# Altium schematic sheet BOOT_JTAG_AUX.SchDoc: =project_title
size Tabloid; CompanyName: Luxonis Holding; Organization: Luxonis Holding; Address1: 1925 Harmony Park Drive; Address2: Westminster, CO; Address3: 80234; Address4: United States; SheetNumber: 7; SheetTotal: 14
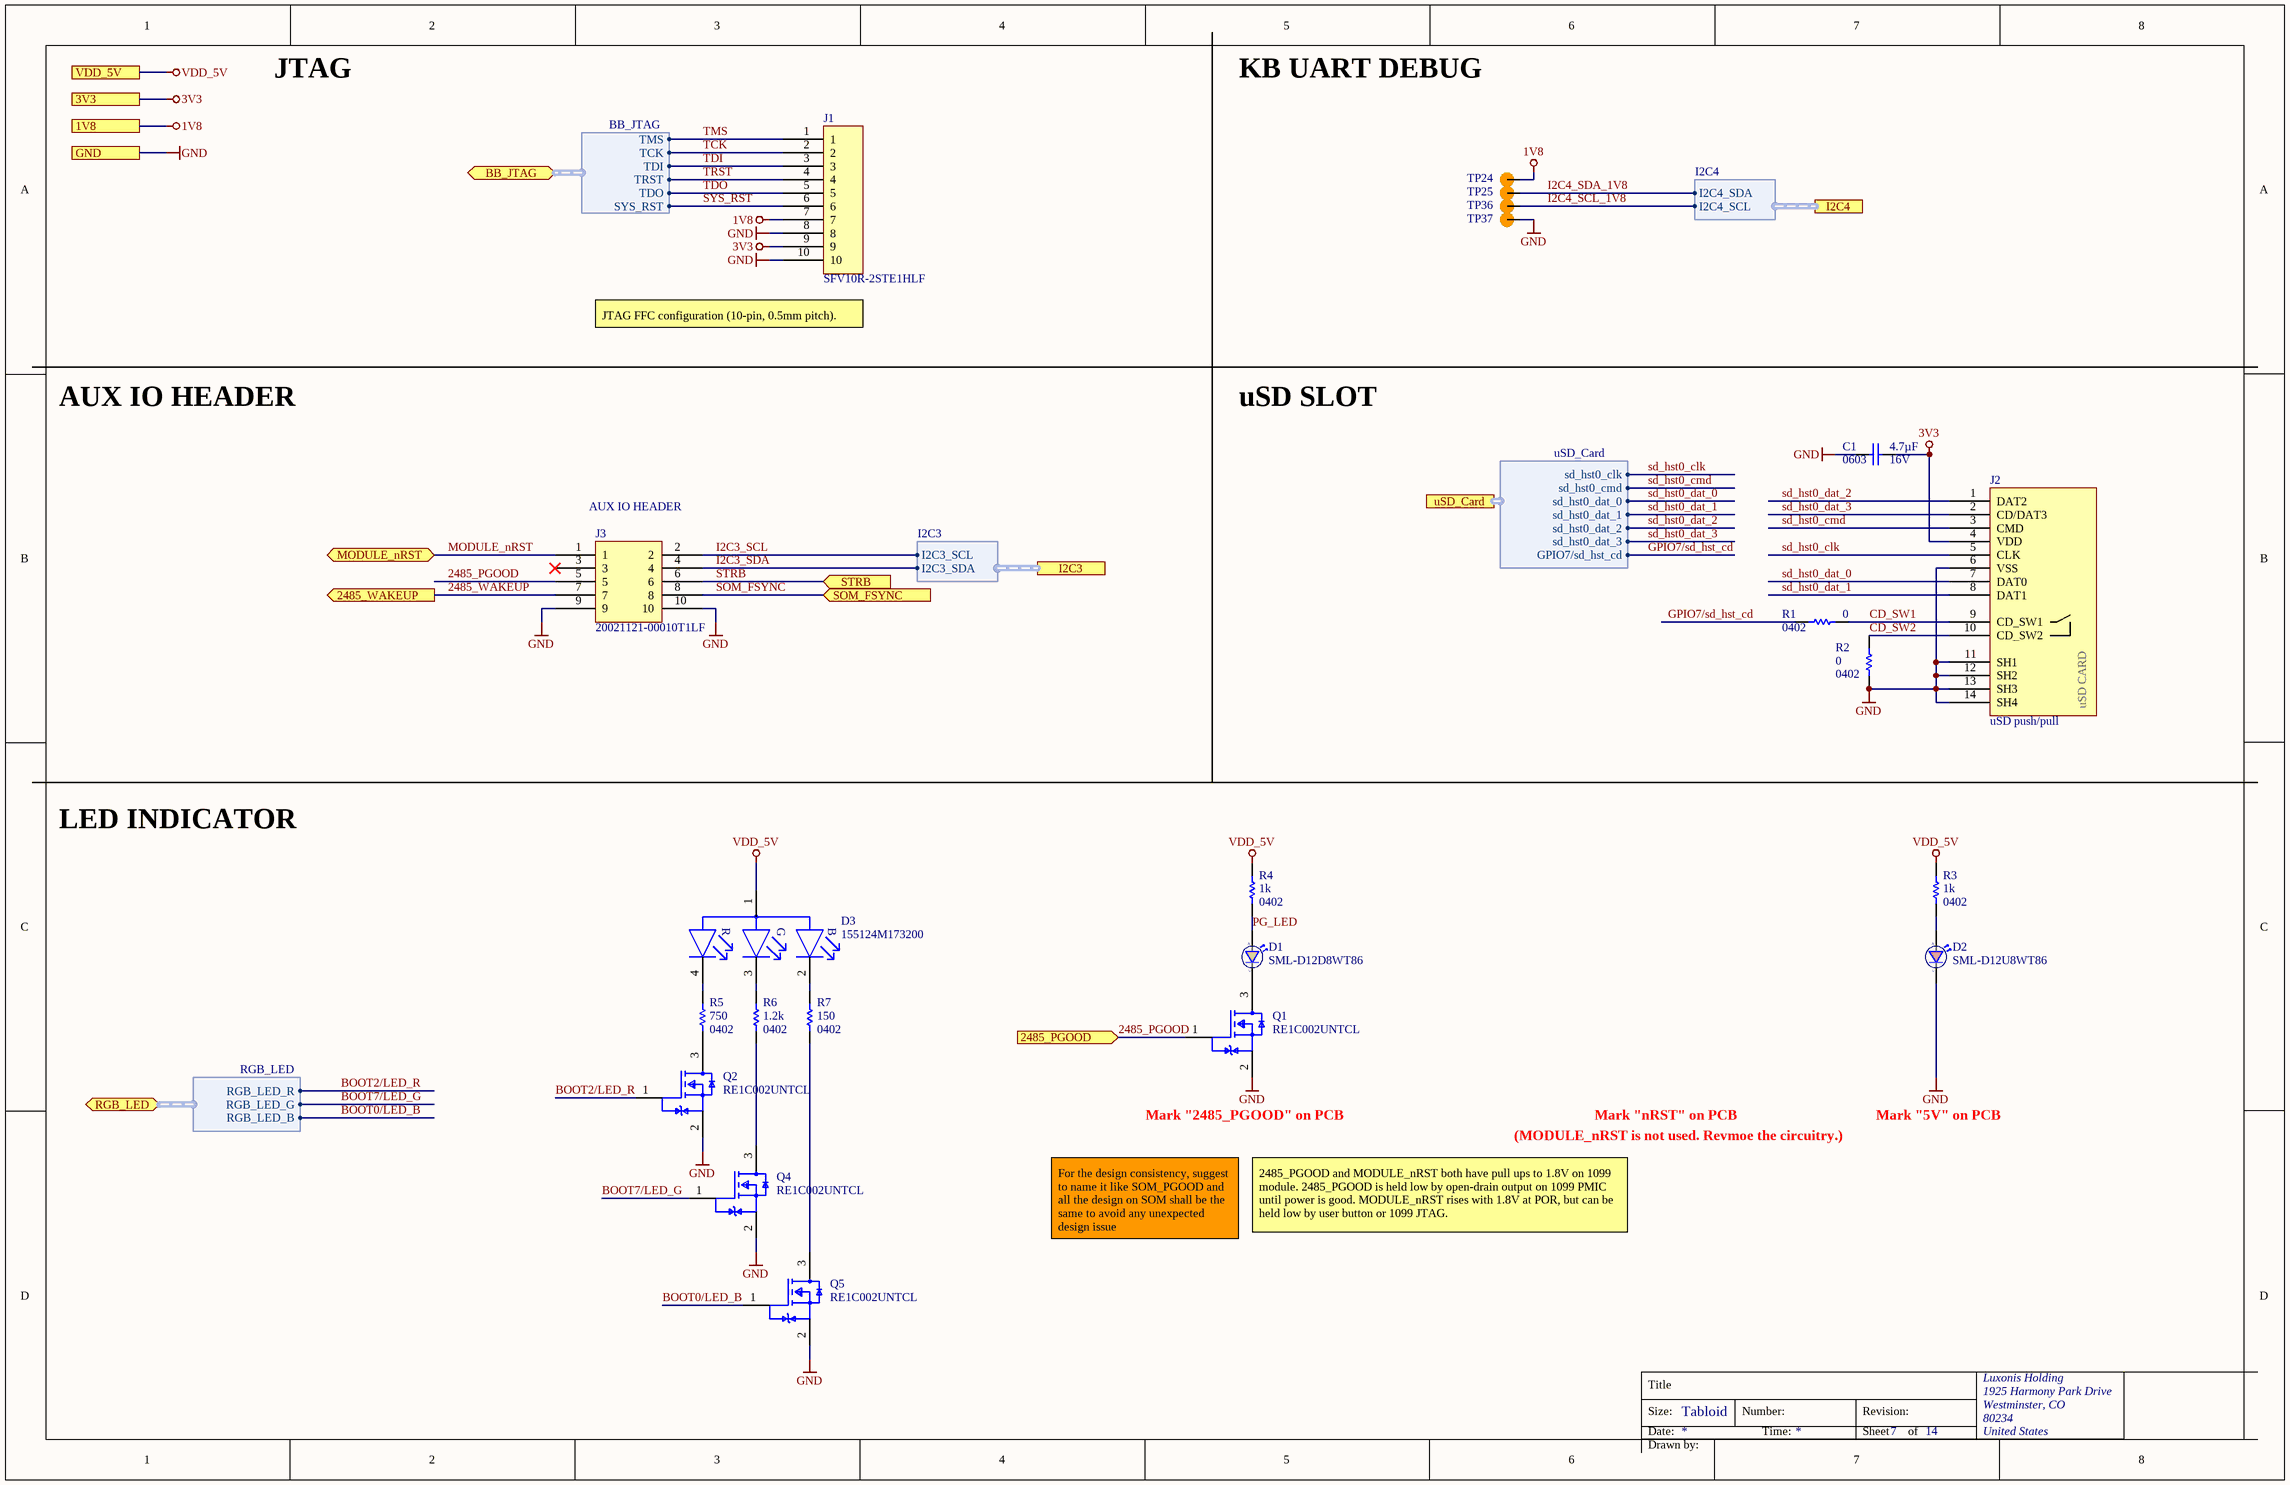
[diagram p0: BOOT_JTAG_AUX.SchDoc]

## Parts
C1  value 4.7µF  Voltage Rating: 16V  Case/Package: 0603  [CAPC0603(1608)100_N]  (hidden comment: GRM188R61C475KAAJD)
D1  SML-D12D8WT86  [SML_D1xx8W]
D2  SML-D12U8WT86  [SML_D1xx8W]
D3  155124M173200  [FP-155124M173200-MFG]
J1  SFV10R-2STE1HLF  [SFV10R-2STE1HLF]
J2  uSD push/pull  [104031-0811]
J3  20021121-00010T1LF  [20021121-00010T1LF]
Q1  RE1C002UNTCL  [RE1C002UNTCL]
Q2  RE1C002UNTCL  [RE1C002UNTCL]
Q4  RE1C002UNTCL  [RE1C002UNTCL]
Q5  RE1C002UNTCL  [RE1C002UNTCL]
R1  value 0  Case/Package: 0402  [RESC0402(1005)_L]  (hidden comment: CRCW04020000Z0ED)
R2  value 0  Case/Package: 0402  [RESC0402(1005)_L]  (hidden comment: CRCW04020000Z0ED)
R3  value 1k  Case/Package: 0402  [RESC0402(1005)_L]  (hidden comment: RC0402FR-071KL)
R4  value 1k  Case/Package: 0402  [RESC0402(1005)_L]  (hidden comment: RC0402FR-071KL)
R5  value 750  Case/Package: 0402  [RESC1005X40X25NL05T05]  (hidden comment: ERJ-2RKF7500X)
R6  value 1.2k  Case/Package: 0402  [RESC1005X40X25NL05T05]  (hidden comment: CRCW04021K20FKED)
R7  value 150  Case/Package: 0402  [RESC1005X40X25NL05T10]  (hidden comment: RC0402FR-07150RL)
TP24  TEST_POINT  [TP075_150_NS]  (value not drawn)  (no BOM)
TP25  TEST_POINT  [TP075_150_NS]  (value not drawn)  (no BOM)
TP36  TEST_POINT  [TP075_150_NS]  (value not drawn)  (no BOM)
TP37  TEST_POINT  [TP075_150_NS]  (value not drawn)  (no BOM)

## Ports
1V8, 3V3, 2485_PGOOD (in), 2485_WAKEUP (out), BB_JTAG (bidir, harness BB_JTAG), GND, I2C3 (harness I2C3), I2C4 (harness I2C4), MODULE_nRST (bidir), RGB_LED (bidir, harness RGB_LED), SOM_FSYNC (in), STRB (in), uSD_Card (harness uSD_Card), VDD_5V

## Harnesses
BB_JTAG: TMS, TCK, TDI, TRST, TDO, SYS_RST
I2C3: I2C3_SDA, I2C3_SCL
uSD_Card: sd_hst0_clk, sd_hst0_cmd, sd_hst0_dat_0, sd_hst0_dat_1, sd_hst0_dat_2, sd_hst0_dat_3, GPIO7/sd_hst_cd
RGB_LED: RGB_LED_G, RGB_LED_B, RGB_LED_R
I2C4: I2C4_SDA, I2C4_SCL

## Nets
1V8: J1.7 TP24.1 ; port 1V8
3V3: C1.1 J1.9 J2.4(VDD) ; port 3V3
GND: C1.2 D2.1(C) J1.8 J1.10 J2.6(VSS) J2.11(SH1) J2.12(SH2) J2.13(SH3) J2.14(SH4) J3.9 J3.10 Q1.2(Source) Q2.2(Source) Q4.2(Source) Q5.2(Source) R2.1 TP37.1 ; port GND
VDD_5V: D3.1(COMMON_ANODE) R3.2 R4.2 ; port VDD_5V
2485_PGOOD: J3.5 Q1.1(Gate) ; port 2485_PGOOD
2485_WAKEUP: J3.7 ; port 2485_WAKEUP
BOOT0/LED_B: Q5.1(Gate) ; port RGB_LED.RGB_LED_B
BOOT2/LED_R: Q2.1(Gate) ; port RGB_LED.RGB_LED_R
BOOT7/LED_G: Q4.1(Gate) ; port RGB_LED.RGB_LED_G
CD_SW1: J2.9(CD_SW1) R1.2
CD_SW2: J2.10(CD_SW2) R2.2
GPIO7/sd_hst_cd: R1.1 ; port uSD_Card.GPIO7/sd_hst_cd
I2C3_SCL: J3.2 ; port I2C3.I2C3_SCL
I2C3_SDA: J3.4 ; port I2C3.I2C3_SDA
I2C4_SCL_1V8: TP36.1 ; port I2C4.I2C4_SCL
I2C4_SDA_1V8: TP25.1 ; port I2C4.I2C4_SDA
MODULE_nRST: J3.1 ; port MODULE_nRST
PG_LED: D1.2(A) R4.1
sd_hst0_clk: J2.5(CLK) ; port uSD_Card.sd_hst0_clk
sd_hst0_cmd: J2.3(CMD) ; port uSD_Card.sd_hst0_cmd
sd_hst0_dat_0: J2.7(DAT0) ; port uSD_Card.sd_hst0_dat_0
sd_hst0_dat_1: J2.8(DAT1) ; port uSD_Card.sd_hst0_dat_1
sd_hst0_dat_2: J2.1(DAT2) ; port uSD_Card.sd_hst0_dat_2
sd_hst0_dat_3: J2.2(CD/DAT3) ; port uSD_Card.sd_hst0_dat_3
SOM_FSYNC: J3.8 ; port SOM_FSYNC
STRB: J3.6 ; port STRB
SYS_RST: J1.6 ; port BB_JTAG.SYS_RST
TCK: J1.2 ; port BB_JTAG.TCK
TDI: J1.3 ; port BB_JTAG.TDI
TDO: J1.5 ; port BB_JTAG.TDO
TMS: J1.1 ; port BB_JTAG.TMS
TRST: J1.4 ; port BB_JTAG.TRST
NetD1_1: D1.1(C) Q1.3(Drain)
NetD2_2: D2.2(A) R3.1
NetD3_2: D3.2(BLUE_C) R7.2
NetD3_3: D3.3(GREEN_C) R6.2
NetD3_4: D3.4(RED_C) R5.2
NetQ2_3: Q2.3(Drain) R5.1
NetQ4_3: Q4.3(Drain) R6.1
NetQ5_3: Q5.3(Drain) R7.1

Not connected (* = marked no-connect by the designer): J3 3*

## Notes on the sheet
- JTAG
- KB UART DEBUG
- (near J1) JTAG FFC configuration (10-pin, 0.5mm pitch).
- AUX IO HEADER
- uSD SLOT
- (near J3) AUX IO HEADER
- LED INDICATOR
- Mark "2485_PGOOD" on PCB
- (MODULE_nRST is not used. Revmoe the circuitry.)
- Mark "nRST" on PCB
- Mark "5V" on PCB
- For the design consistency, suggest to name it like SOM_PGOOD and all the design on SOM shall be the same to avoid any unexpected design issue
- 2485_PGOOD and MODULE_nRST both have pull ups to 1.8V on 1099 module. 2485_PGOOD is held low by open-drain output on 1099 PMIC until power is good. MODULE_nRST rises with 1.8V at POR, but can be held low by user button or 1099 JTAG.
- Title
- Size:
- Date:
- Tabloid
- Number:
- Time:
- Revision:
- Sheet
- of
- Drawn by:
- (in symbol 104031-0811) uSD CARD
- (in symbol CMP-007-00038-2) R; G; B

## Library data of the parts
C1 = CMP-004-000020-4: CAP CER 4.7UF 16V X5R 0603 10%; Manufacturer 1: Murata; Max Operating Temperature: 85°C; Dielectric: X5R; Design Item ID: GRM188R61C475KAAJD; Depth: 0.8mm; Width: 0.8mm; Manufacturer 2: Murata; Manufacturer Part Number 3: GRM188R61C475KAAJD; Manufacturer Part Number 2: GRM188R61C475KAAJD; ComponentLink1Description: https://datasheet.ciiva.com/14813/595grm188r61c475kaaj23-14813668.pdf?src-supplier=Arrow; ComponentLink1URL: https://datasheet.ciiva.com/14813/595grm188r61c475kaaj23-14813668.pdf?src-supplier=Arrow; Manufacturer Part Number 1: GRM188R61C475KAAJD; Manufacturer 3: Murata; Mounting Technology: SMT; Tolerance: 10%; Length: 1.6mm; Min Operating Temperature: -55°C; Height: 0.8mm
D1 = CMP-111-000003-2: LED ORANGE DIFFUSED 0603 SMD Orange 605nm LED Indication - Discrete 2.2V 0603 (1608 Metric); Manufacturer 1: Rohm; Forward Current: 20mA; Case/Package: 0603; Manufacturer Part Number 1: SML-D12D8WT86; Max Operating Temperature: 85°C; Forward Voltage: 2.2V; Min Operating Temperature: -40°C; Color: Orange
D2 = CMP-111-000005-2: LED RED DIFFUSED 0603 SMD Red 620nm LED Indication - Discrete 2.2V 0603 (1608 Metric); Manufacturer 1: Rohm; Forward Current: 20mA; Manufacturer Part Number 1: SML-D12U8WT86; Case/Package: 0603; Forward Voltage: 2.2V; Min Operating Temperature: -40°C; Color: Red; Max Operating Temperature: 85°C
D3 = CMP-007-00038-2: Triple Color LED; Manufacturer 1: Wurth Elektronik; Max Current Rating: 30mA; Viewing Angle: 120°; Colour: RGB; Forward Current: 20mA; Case/Package: 1204; Manufacturer Part Number 1: 155124M173200
J1 = CMP-005-000024-3: CONN FFC TOP 10POS 0.50MM R/A; Manufacturer 1: Amphenol FCI; Pitch: 0.5mm; Voltage Rating: 50V; Gender: Female; Orientation: Right Angle; Max Operating Temperature: 105°C; Min Operating Temperature: -55°C; Mount: Surface Mount; Manufacturer Part Number 1: SFV10R-2STE1HLF; Pins: 10
J2 = 104031-0811: CONN MICRO SD CARD PUSH-PULL R/A; Manufacturer 1: Molex; Manufacturer Part Number 1: 104031-0811; Supplier 1: Digi-Key; Stock 1: 19400; Pricing 1: 1=2.02000, 10=1.82900, 25=1.71680, 50=1.64220, 100=1.56760, 250=1.41828, 500=1.30630, 1000=1.11969 (USD); RoHS: Yes; Supplier 2: Newark; Supplier 3: Mouser; Supplier Part Number 1: WM6357CT-ND; Supplier Part Number 2: 99R5410; Supplier Part Number 3: 538-104031-0811
J3 = 20021121-00010T1LF: CONN HEADER SMD 10POS 1.27MM; Manufacturer 1: Amphenol FCI; Number of Contacts: 10; Contact Resistance: 30mR; Max Voltage Rating (AC): 125V; Connector Type: Male Pin; Row Spacing: 0.05inch; Supplier 1: Digi-Key; Manufacturer Part Number 1: 20021121-00010T1LF; Stock 1: 1465; Pricing 1: 1=0.77000, 10=0.71800, 100=0.55040, 500=0.47860, 1000=0.39485, 5000=0.34699, 10000=0.32306 (USD); RoHS: Yes; Mount: Surface Mount; Contact Plating: Gold; Color: Black; Contact Material: Copper Alloy; Housing Color: Black; Housing Material: Thermoplastic; Min Operating Temperature: -40°C; Max Operating Temperature: 85°C; Number of Rows: 2; Termination: Solder; Package Quantity: 93; Packaging: Rail/Tube; Number of Positions: 10; Orientation: Straight; Length: 6.35mm; Pitch: 1.27mm; Contact Mating Length: 0.12inch; Depth: 3.4mm; ComponentLink1URL: https://datasheet.ciiva.com/18659/20021121-18659066.pdf?src-supplier=Digi-Key; ComponentLink1Description: https://datasheet.ciiva.com/18659/20021121-18659066.pdf?src-supplier=Digi-Key; ComponentLink2URL: https://datasheet.ciiva.com/10033/20021121-10033582.pdf?src-supplier=Avnet; ComponentLink2Description: https://datasheet.ciiva.com/10033/20021121-10033582.pdf?src-supplier=Avnet; Supplier Part Number 1: 609-6529-ND; Supplier 2: Mouser; Supplier 3: TTI; Supplier Part Number 2: 649-200211210010T1LF; Supplier Part Number 3: 20021121-00010T1LF
Q1 Q2 Q4 Q5 = CMP-120-000001-2: MOSFET N-CH 20V 0.2A EMT3; Manufacturer 1: Rohm; Continuous Drain Current: 200mA; Case/Package: SOT-89; Manufacturer Part Number 1: RE1C002UNTCL; Design Item ID: RE1C002UNTCL; Max Drain to Source Voltage: 20V
R1 R2 = CMP-013-000022-11: RES SMD 0 OHM 5% 1/16W 0402; Manufacturer 1: Vishay; Voltage Rating: 50V; Power Rating: 63mW; Max Operating Temperature: 155°C; Manufacturer Part Number 1: CRCW04020000Z0ED; Tolerance: 5%; Min Operating Temperature: -55°C; Design Item ID: CRCW04020000Z0ED
R3 R4 = CMP-013-000004-10: RES SMD 1K OHM 1% 1/16W 0402; Manufacturer 1: Yageo; Power Rating: 62.5mW; Voltage Rating: 50V; Min Operating Temperature: -55°C; Design Item ID: RC0402FR-071KL; Tolerance: 1%; Max Operating Temperature: 155°C; Manufacturer Part Number 1: RC0402FR-071KL
R5 = CMP-009-00197-8: RES SMD 750 OHM 1% 0.1W 0402; Manufacturer 1: Panasonic; Power Rating: 100mW; Manufacturer Part Number 1: ERJ-2RKF7500X; Tolerance: 1%
R6 = CMP-009-00198-15: RES SMD 1.2K OHM 1% 0.063W 0402; Manufacturer 1: Vishay; Voltage Rating: 50V; Power Rating: 63mW; Manufacturer Part Number 1: CRCW04021K20FKED; Tolerance: 1%
R7 = CMP-009-00196-8: RES SMD 150 OHM 1% 1/16W 0402; Manufacturer 1: Yageo; Voltage Rating: 50V; Tolerance: 1%; Manufacturer Part Number 1: RC0402FR-07150RL
TP24 TP25 TP36 TP37 = CMP-015-000000-2: Manufacturer Part Number 1: /; Source: LuxonisMaster.SchLib; Design Item ID: TEST_POINT